# Altium schematic sheet MCU_Init.SchDoc: MCU
size A4; Revision: 1.0; SheetNumber: 4; SheetTotal: 11; Class: A
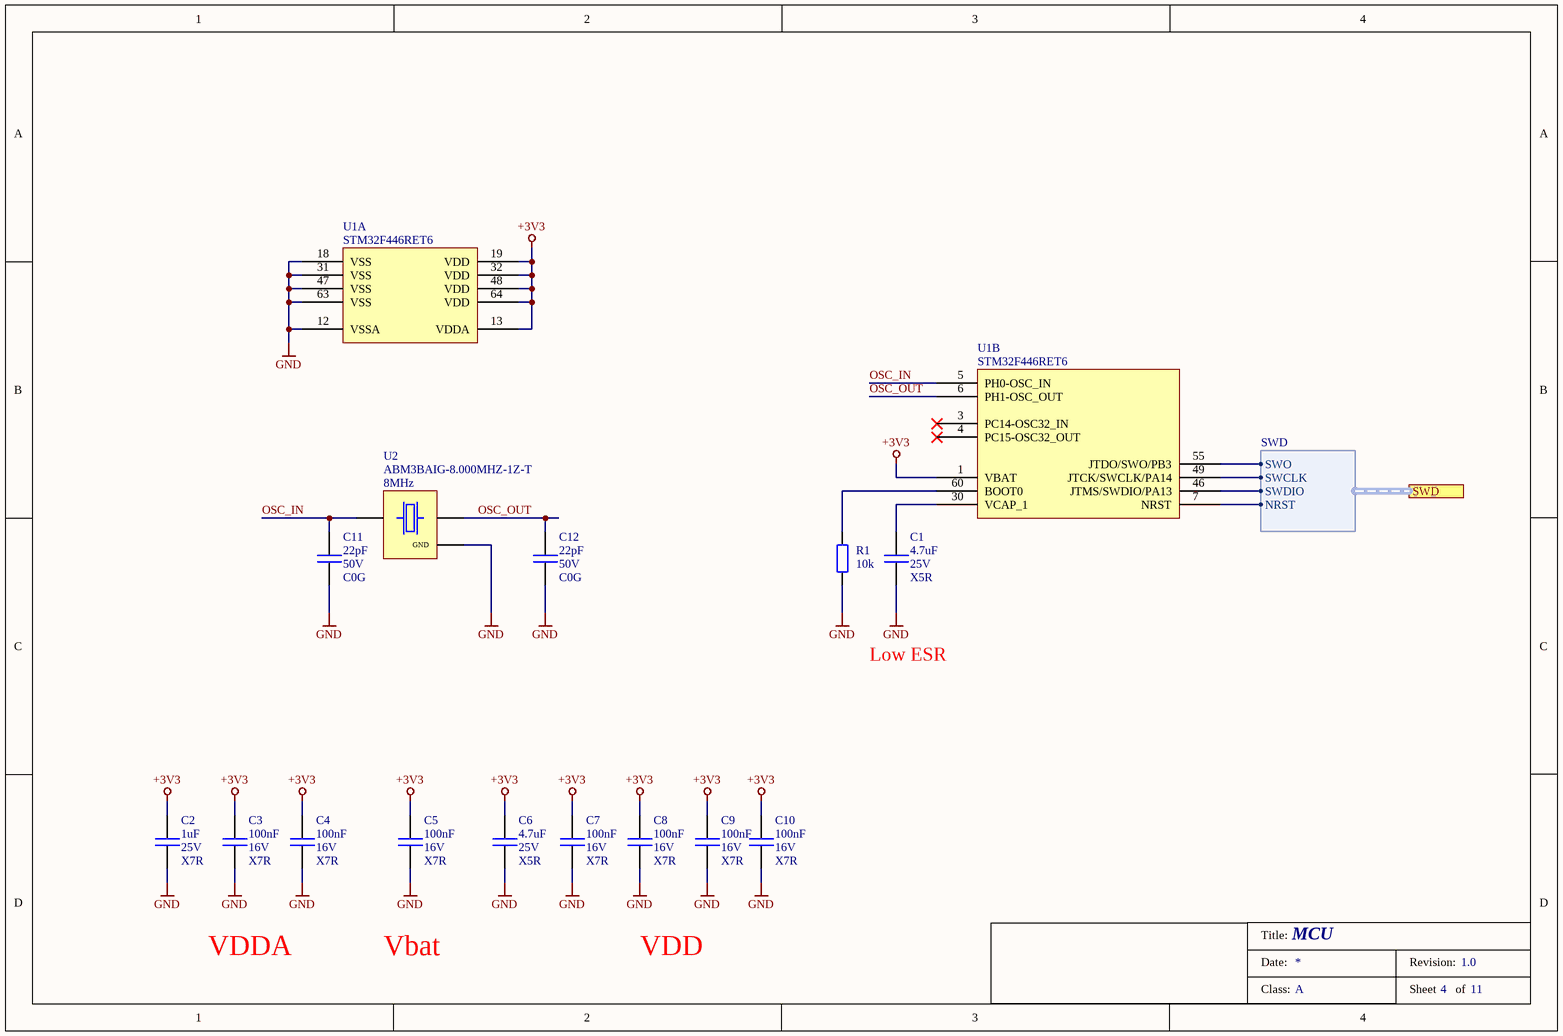
[diagram p0: MCU_Init.SchDoc]

## Parts
C1  value 4.7uF  Voltage: 25V  Dielectric: X5R  [C_0603]  (hidden comment: C)
C2  value 1uF  Voltage: 25V  Dielectric: X7R  [C_0603]  (hidden comment: C)
C3  value 100nF  Voltage: 16V  Dielectric: X7R  [C_0402]  (hidden comment: C)
C4  value 100nF  Voltage: 16V  Dielectric: X7R  [C_0402]  (hidden comment: C)
C5  value 100nF  Voltage: 16V  Dielectric: X7R  [C_0402]  (hidden comment: C)
C6  value 4.7uF  Voltage: 25V  Dielectric: X5R  [C_0603]  (hidden comment: C)
C7  value 100nF  Voltage: 16V  Dielectric: X7R  [C_0402]  (hidden comment: C)
C8  value 100nF  Voltage: 16V  Dielectric: X7R  [C_0402]  (hidden comment: C)
C9  value 100nF  Voltage: 16V  Dielectric: X7R  [C_0402]  (hidden comment: C)
C10  value 100nF  Voltage: 16V  Dielectric: X7R  [C_0402]  (hidden comment: C)
C11  value 22pF  Voltage: 50V  Dielectric: C0G  [C_0603]  (hidden comment: C)
C12  value 22pF  Voltage: 50V  Dielectric: C0G  [C_0603]  (hidden comment: C)
R1  value 10k  [R_0402]  (hidden comment: R)
U1  value STM32F446RET6  [LQFP64]  (hidden comment: MCU_STM32F446RET6)  (parts A,B of 3)
U2  value ABM3BAIG-8.000MHZ-1Z-T  Frequency: 8MHz  [CLK_ABM3BAIG_8_1Z_T]  (hidden comment: CLK_Crystal_4)

## Ports
SWD (harness SWD)

## Harnesses
SWD: SWO, SWCLK, SWDIO, NRST

## Nets
+3V3: C2.1 C3.1 C4.1 C5.1 C6.1 C7.1 C8.1 C9.1 C10.1 U1.1(VBAT) U1.13(VDDA) U1.19(VDD) U1.32(VDD) U1.48(VDD) U1.64(VDD)
GND: C1.2 C2.2 C3.2 C4.2 C5.2 C6.2 C7.2 C8.2 C9.2 C10.2 C11.2 C12.2 R1.1 U1.12(VSSA) U1.18(VSS) U1.31(VSS) U1.47(VSS) U1.63(VSS) U2.2(GND)
OSC_IN: C11.1 U1.5(PH0-OSC_IN) U2.1
OSC_OUT: C12.1 U1.6(PH1-OSC_OUT) U2.3
NetC1_1: C1.1 U1.30(VCAP_1)
NetR1_2: R1.2 U1.60(BOOT0)
NetU1_7: U1.7(NRST) ; port SWD.NRST
NetU1_46: U1.46(JTMS/SWDIO/PA13) ; port SWD.SWDIO
NetU1_49: U1.49(JTCK/SWCLK/PA14) ; port SWD.SWCLK
NetU1_55: U1.55(JTDO/SWO/PB3) ; port SWD.SWO

Not connected (* = marked no-connect by the designer): U1 3(PC14-OSC32_IN)* 4(PC15-OSC32_OUT)*

## Notes on the sheet
- Low ESR
- VDDA
- Vbat
- VDD
- Title:
- Date:
- Revision:
- Class:
- Sheet
- of

## Library data of the parts
C1 C6 = C_4.7uF_25V_0603: Capacitor; Manufacturer: TDK; Manufacturer Part Number: C1608X5R1E475K080AC; Tmax: 85; Tmin: -55; Grade: 3; Fail Rate: A; Tolerance: 10%; Part Number: C_4.7uF_25V_0603; HelpURL: https://product.tdk.com/system/files/dam/doc/product/capacitor/ceramic/mlcc/catalog/mlcc_commercial_general_en.pdf; Supplier 1: Mouser; Supplier Part Number 1: 810-C1608X5R1E475K; Status: Active
C2 = C_1uF_25V_0603: Capacitor; Manufacturer: Murata; Manufacturer Part Number: C0603T222K5RAC7867 / GCJ188R71E105KA01D; Tmax: 125; Tmin: -55; Grade: 2; Fail Rate: A; Tolerance: 10%; Part Number: C_1uF_25V_0603; HelpURL: https://www.murata.com/en-eu/api/pdfdownloadapi?cate=luCeramicCapacitorsSMD&partno=GCJ188R71E105KA01%23; Supplier 1: Mouser; Supplier Part Number 1: 81-GCJ188R71E105KA1D; Status: Active
C3-C5 C7-C10 = C_100nF_16V_0402: Capacitor; Manufacturer: Kemet; Manufacturer Part Number: C0402T104K4RAC7867; Tmax: 125; Tmin: -55; Grade: 2; Fail Rate: A; Tolerance: 10%; Part Number: C_100nF_16V_0402; HelpURL: https://api.kemet.com/component-edge/download/specsheet/C0402T104K4RACTU.pdf; Supplier 2: Mouser; Supplier Part Number 2: 80-C0402T104K4RACTU; Supplier 1: Digi-Key; Supplier Part Number 1: 399-17387-1-ND; Status: Active
C11 C12 = C_22pF_50V_0603: Capacitor; Manufacturer: Kemet; Manufacturer Part Number: C0603T220J5GAC7867; Tmax: 125; Tmin: -55; Grade: 2; Fail Rate: A; Tolerance: 5%; Part Number: C_22pF_50V_0603; HelpURL: https://content.kemet.com/datasheets/KEM_C1026_C0G_COTS_SMD.pdf; Supplier 1: Digi-Key; Supplier Part Number 1: 399-20427-1-ND; Status: Active
R1 = R_10k_50V_0402: Manufacturer: Vishay; Manufacturer Part Number: MCS0402PD1002DE500; Voltage: 50V; RMS Power: 0.2W; TCR: 25ppm; Tmax: 175; Tmin: -55; Grade: 2; Part Number: R_10k_50V_0402; HelpURL: https://www.vishay.com/docs/28916/mcxhp.pdf; Supplier 2: Mouser; Supplier Part Number 2: 594-MCS0402PD1002DP5; Supplier 1: Digi-Key; Supplier Part Number 1: 749-1515-1-ND; Status: Active
U1 = STM32F446RET6: ARM Microcontroller, Cortex-M4 core; Manufacturer: St; Tmax: 85; Tmin: -40; Grade: 3; Part Number: STM32F446RET6; HelpURL: https://www.st.com/content/ccc/resource/technical/document/datasheet/65/cb/75/50/53/d6/48/24/DM00141306.pdf/files/DM00141306.pdf/jcr:content/translations/en.DM00141306.pdf; Manufacturer Part Number: STM32F446RET6; Supplier 1: Mouser; Supplier Part Number 1: 511-STM32F446RET6; Status: Active
U2 = ABM3BAIG-8.000MHZ-1Z-T: Crystal; Manufacturer: ABRACON; Frequency Stability: ±50 ppm; Tmax: 125; Tmin: -40; Grade: 2; Part Number: ABM3BAIG-8.000MHZ-1Z-T; HelpURL: https://abracon.com/AIGcrystals/ABM3BAIG.pdf; Manufacturer Part Number: ABM3BAIG-8.000MHZ-1Z-T; Supplier 1: Mouser; Supplier Part Number 1: 815-M3BAIG-8-1ZT; Status: Active